# Altium schematic sheet UNG8077_EVB_7801-9031_A_4-KSZ9031.SchDoc
size 416 x 264 mm; SheetNumber: 4; PageTitle: KSZ9031RNX; PageSetup: Record=PageOptions|CenterHorizontal=True|CenterVertical=True|PrintScale=1.02|XCorrection=1.00|YCorrection=1.00|PrintKind=0|BorderSize=5000000|LeftOffset=0|BottomOffset=0|Orientation=2|PaperLength=1000|PaperWidth=1000|Scale=100|PaperSource=7|PrintQuality=-3|MediaType=1|DitherType=10|PrintScaleMode=1|PaperKind=11 x 17|PaperIndex=119; DocumentFullPathAndName: //depot_np_hweng_boards/ung_hweng/UNG_8077_LAN7801-KSZ9031_DemoEVB/A/
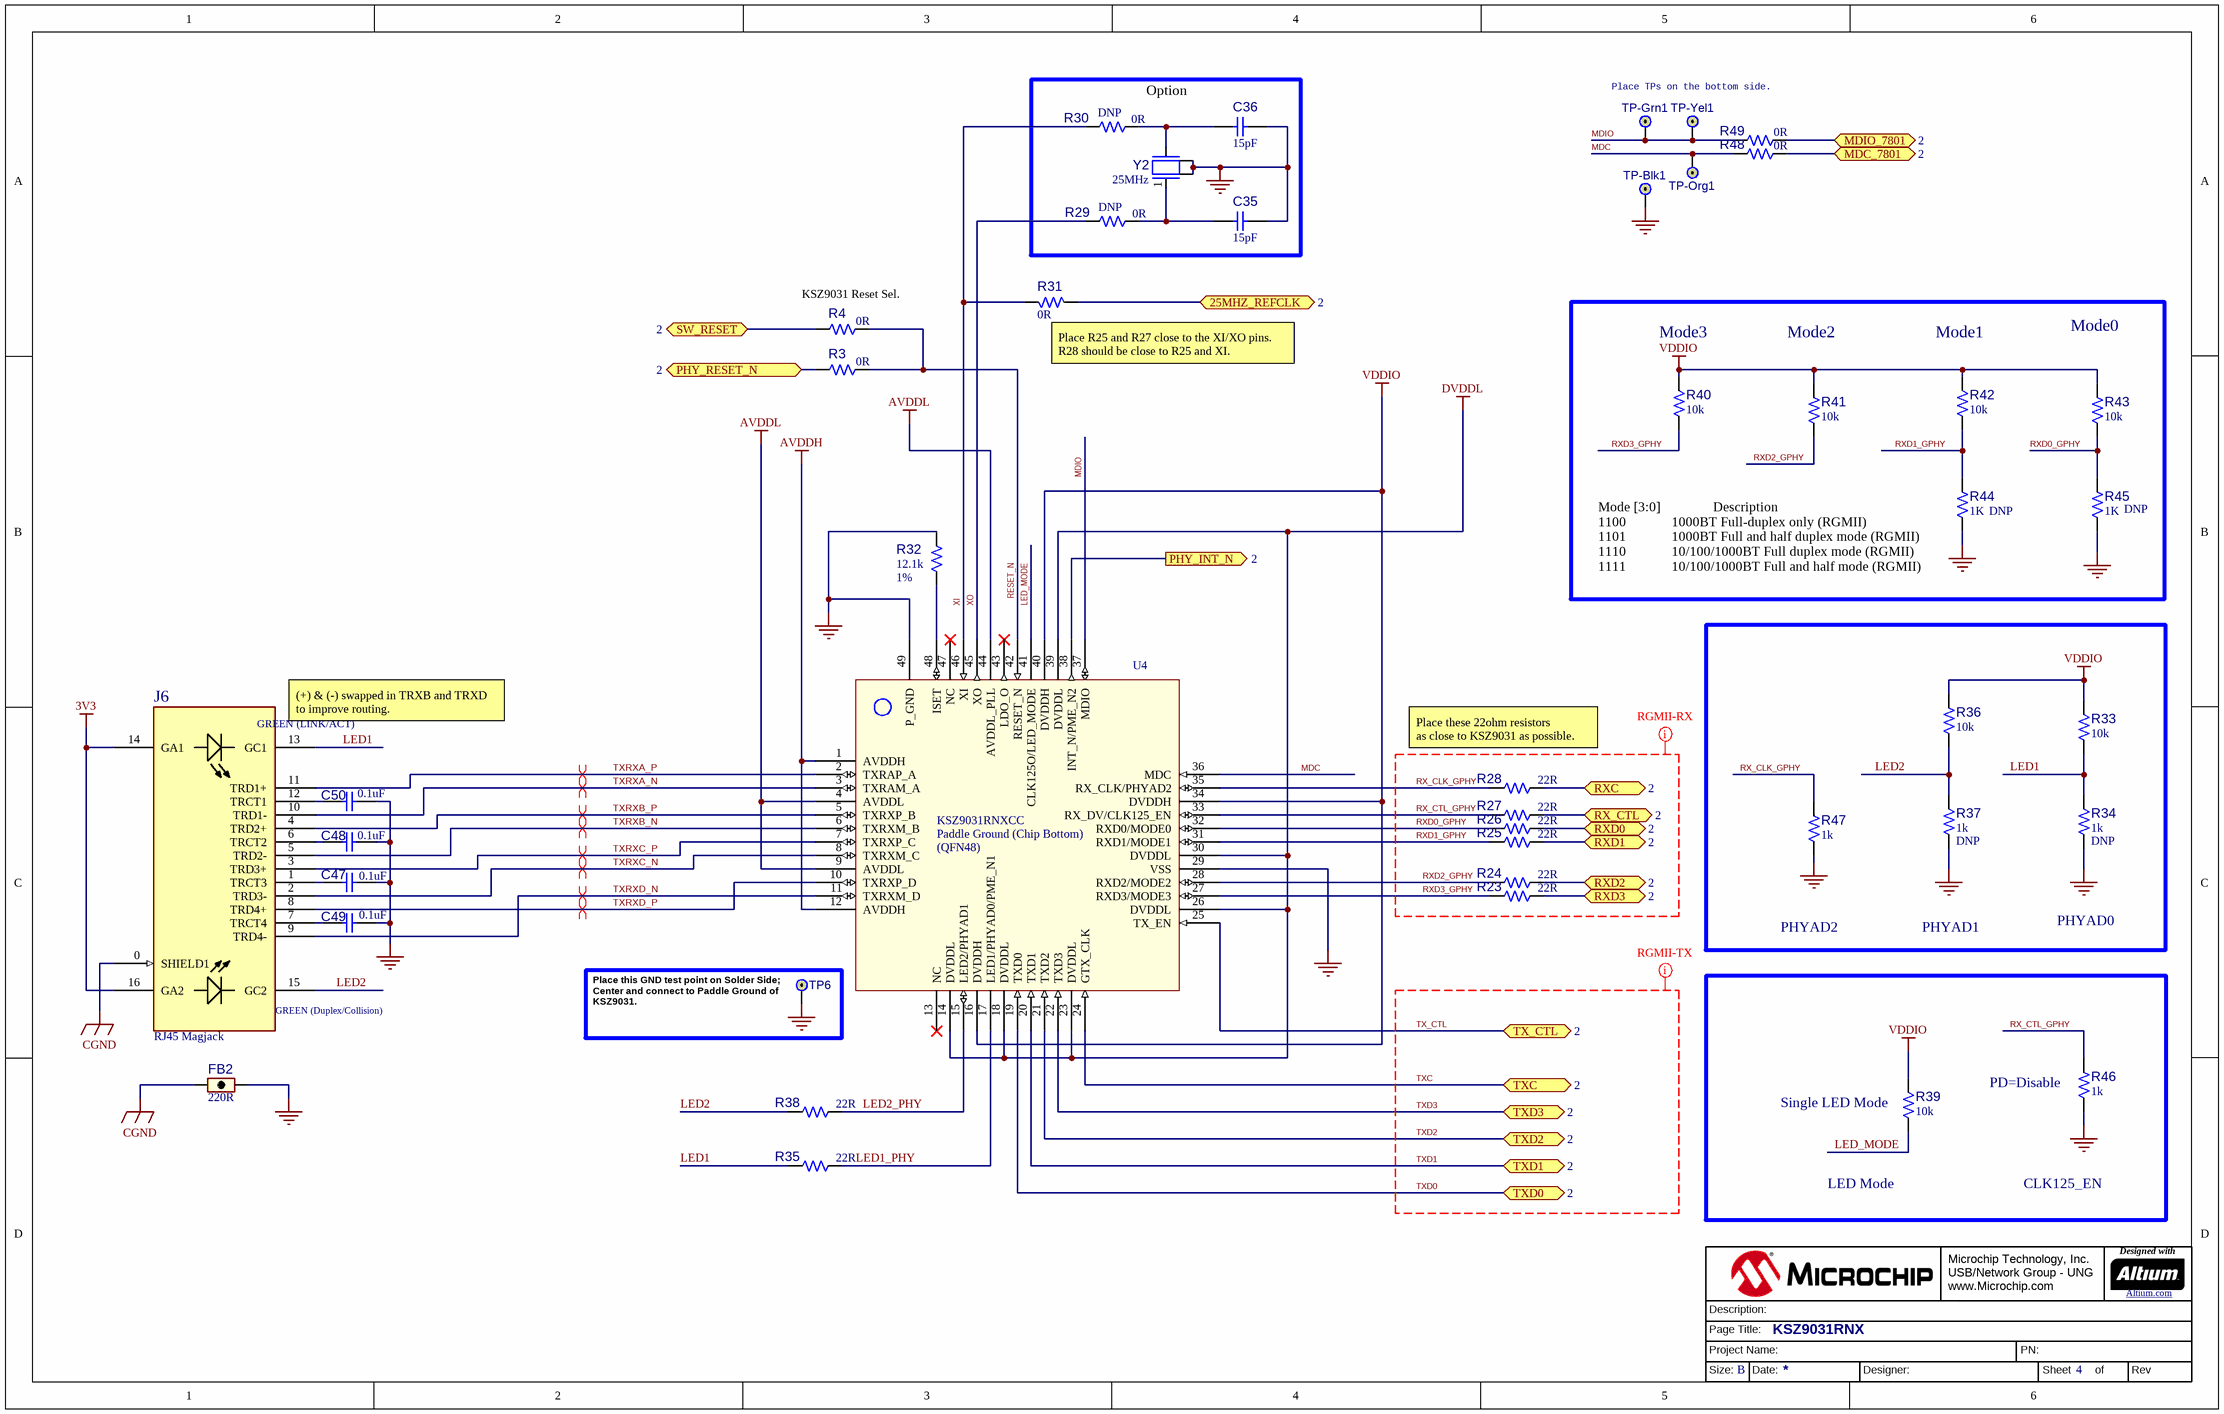
[diagram p0: UNG8077_EVB_7801-9031_A_4-KSZ9031.SchDoc]

## Parts
?  (no value)  (graphical)
C35  value 15pF  [CAP_C_0402]  (hidden comment: Capacitor NP)
C36  value 15pF  [CAP_C_0402]  (hidden comment: Capacitor NP)
C47  value 0.1uF  [CAP_C_0402]  (hidden comment: CAP CER 0.1UF 35V)
C48  value 0.1uF  [CAP_C_0402]  (hidden comment: CAP CER 0.1UF 35V)
C49  value 0.1uF  [CAP_C_0402]  (hidden comment: CAP CER 0.1UF 35V)
C50  value 0.1uF  [CAP_C_0402]  (hidden comment: CAP CER 0.1UF 35V)
FB2  value 220R  [IND_C_0603]  (hidden comment: Ferrite Bead)
J6  RJ45 Magjack  [CON_MODULAR_RJ45_TH_RA_RJMG2012211A0FR]
R3  value 0R  [RES_C_0603]  (hidden comment: Resistor)
R4  value 0R  [RES_C_0603]  (hidden comment: Resistor)
R23  value 22R  [RES_C_0402]  (hidden comment: Resistor)
R24  value 22R  [RES_C_0402]  (hidden comment: Resistor)
R25  value 22R  [RES_C_0402]  (hidden comment: Resistor)
R26  value 22R  [RES_C_0402]  (hidden comment: Resistor)
R27  value 22R  [RES_C_0402]  (hidden comment: Resistor)
R28  value 22R  [RES_C_0402]  (hidden comment: Resistor)
R29  value 0R  Populated: DNP  [RES_C_0603]  (hidden comment: Resistor)
R30  value 0R  Populated: DNP  [RES_C_0603]  (hidden comment: Resistor)
R31  value 0R  [RES_C_0603]  (hidden comment: Resistor)
R32  value 12.1k  Tolerance: 1%  [RES_C_0603]  (hidden comment: Resistor)
R33  value 10k  [RES_C_0603]  (hidden comment: Resistor)
R34  value 1k  Populated: DNP  [RES_C_0603]  (hidden comment: Resistor)
R35  value 22R  [RES_C_0402]  (hidden comment: Resistor)
R36  value 10k  [RES_C_0603]  (hidden comment: Resistor)
R37  value 1k  Populated: DNP  [RES_C_0603]  (hidden comment: Resistor)
R38  value 22R  [RES_C_0402]  (hidden comment: Resistor)
R39  value 10k  [RES_C_0603]  (hidden comment: Resistor)
R40  value 10k  [RES_C_0603]  (hidden comment: Resistor)
R41  value 10k  [RES_C_0603]  (hidden comment: Resistor)
R42  value 10k  [RES_C_0603]  (hidden comment: Resistor)
R43  value 10k  [RES_C_0603]  (hidden comment: Resistor)
R44  value 1K  Populated: DNP  [RES_C_0603]  (hidden comment: Resistor)
R45  value 1K  Populated: DNP  [RES_C_0603]  (hidden comment: Resistor)
R46  value 1k  [RES_C_0603]  (hidden comment: Resistor)
R47  value 1k  [RES_C_0603]  (hidden comment: Resistor)
R48  value 0R  [RES_C_0603]  (hidden comment: Resistor)
R49  value 0R  [RES_C_0603]  (hidden comment: Resistor)
TP6  Jumper  [TP_PAD_VIA_20-10]  (value not drawn)
TP-Blk1  Jumper  [TP_PAD51D36]  (value not drawn)  (no BOM)
TP-Grn1  Jumper  [TP_PAD51D36]  (value not drawn)  (no BOM)
TP-Org1  Jumper  [TP_PAD51D36]  (value not drawn)  (no BOM)
TP-Yel1  Jumper  [TP_PAD51D36]  (value not drawn)  (no BOM)
U4  (no value)  [QFN-48_7x7-EP5.1sq]
Y2  Frequency: 25MHz  [XTAL_4PIN_3M2X2M5]  (hidden comment: XTAL 25MHz 4 pins 3225)

## Blocks framed on the sheet
Option: C35 C36 R29 R30 Y2

## Ports
25MHZ_REFCLK (bidir, see 2), MDC_7801 (bidir, see 2), MDIO_7801 (bidir, see 2), PHY_INT_N (out, see 2), PHY_RESET_N (bidir, see 2), RX_CTL (bidir, see 2), RXC (bidir, see 2), RXD0 (bidir, see 2), RXD1 (bidir, see 2), RXD2 (bidir, see 2), RXD3 (bidir, see 2), SW_RESET (bidir, see 2), TX_CTL (bidir, see 2), TXC (bidir, see 2), TXD0 (bidir, see 2), TXD1 (bidir, see 2), TXD2 (bidir, see 2), TXD3 (bidir, see 2)

## Nets
3V3: J6.14(GA1) J6.16(GA2)
AVDDH: U4.1(AVDDH) U4.12(AVDDH)
AVDDL: U4.4(AVDDL) U4.9(AVDDL) U4.44(AVDDL_PLL)
CGND: FB2.1 J6.0(SHIELD1)
DVDDL: U4.14(DVDDL) U4.18(DVDDL) U4.23(DVDDL) U4.26(DVDDL) U4.30(DVDDL) U4.39(DVDDL)
GND: C35.2 C36.2 C47.2 C48.2 C49.2 C50.2 FB2.2 R32.2 R34.1 R37.1 R44.1 R45.1 R46.1 R47.1 TP6.1(P1) TP-Blk1.1(P1) U4.29(VSS) U4.49(P_GND) Y2.2(GND) Y2.4(GND)
VDDIO: R33.1 R36.1 R39.1 R40.1 R41.1 R42.1 R43.1 U4.16(DVDDH) U4.34(DVDDH) U4.40(DVDDH)
25MHZ_REFCLK: R31.1 ; port 25MHZ_REFCLK
LED1: J6.13(GC1) R33.2 R34.2 R35.1
LED1_PHY: R35.2 U4.17(LED1/PHYAD0/PME_N1)
LED2: J6.15(GC2) R36.2 R37.2 R38.1
LED2_PHY: R38.2 U4.15(LED2/PHYAD1)
LED_MODE: R39.2 U4.41(CLK125O/LED_MODE)
MDC: R48.1 TP-Org1.1(P1) U4.36(MDC)
MDC_7801: R48.2 ; port MDC_7801
MDIO: R49.1 TP-Grn1.1(P1) TP-Yel1.1(P1) U4.37(MDIO)
MDIO_7801: R49.2 ; port MDIO_7801
PHY_INT_N: U4.38(INT_N/PME_N2) ; port PHY_INT_N
PHY_RESET_N: R3.1 ; port PHY_RESET_N
RESET_N: R3.2 R4.2 U4.42(RESET_N)
RX_CLK_GPHY: R28.1 R47.2 U4.35(RX_CLK/PHYAD2)
RX_CTL: R27.2 ; port RX_CTL
RX_CTL_GPHY: R27.1 R46.2 U4.33(RX_DV/CLK125_EN)
RXC: R28.2 ; port RXC
RXD0: R26.2 ; port RXD0
RXD0_GPHY: R26.1 R43.2 R45.2 U4.32(RXD0/MODE0)
RXD1: R25.2 ; port RXD1
RXD1_GPHY: R25.1 R42.2 R44.2 U4.31(RXD1/MODE1)
RXD2: R24.2 ; port RXD2
RXD2_GPHY: R24.1 R41.2 U4.28(RXD2/MODE2)
RXD3: R23.2 ; port RXD3
RXD3_GPHY: R23.1 R40.2 U4.27(RXD3/MODE3)
SW_RESET: R4.1 ; port SW_RESET
TX_CTL: U4.25(TX_EN) ; port TX_CTL
TXC: U4.24(GTX_CLK) ; port TXC
TXD0: U4.19(TXD0) ; port TXD0
TXD1: U4.20(TXD1) ; port TXD1
TXD2: U4.21(TXD2) ; port TXD2
TXD3: U4.22(TXD3) ; port TXD3
TXRXA_N: J6.10(TRD1-) U4.3(TXRAM_A)
TXRXA_P: J6.11(TRD1+) U4.2(TXRAP_A)
TXRXB_N: J6.5(TRD2-) U4.6(TXRXM_B)
TXRXB_P: J6.4(TRD2+) U4.5(TXRXP_B)
TXRXC_N: J6.2(TRD3-) U4.8(TXRXM_C)
TXRXC_P: J6.3(TRD3+) U4.7(TXRXP_C)
TXRXD_N: J6.9(TRD4-) U4.11(TXRXM_D)
TXRXD_P: J6.8(TRD4+) U4.10(TXRXP_D)
XI: R30.1 R31.2 U4.46(XI)
XO: R29.1 U4.45(XO)
NetC35_1: C35.1 R29.2 Y2.1(Osc1)
NetC36_1: C36.1 R30.2 Y2.3(Osc2)
NetC47_1: C47.1 J6.1(TRCT3)
NetC48_1: C48.1 J6.6(TRCT2)
NetC49_1: C49.1 J6.7(TRCT4)
NetC50_1: C50.1 J6.12(TRCT1)
NetR32_1: R32.1 U4.48(ISET)

Not connected (* = marked no-connect by the designer): U4 13(NC)* 43(LDO_O)* 47(NC)*

## Layout directives
net class RGMII-RX: RX_CLK_GPHY, RX_CTL_GPHY, RXD0_GPHY, RXD1_GPHY, RXD2_GPHY, RXD3_GPHY
differential pair; net class GBE: TXRXA_N, TXRXA_P, TXRXB_N, TXRXB_P, TXRXC_N, TXRXC_P, TXRXD_N, TXRXD_P
net class RGMII-TX: TX_CTL, TXC, TXD0, TXD1, TXD2, TXD3

## Notes on the sheet
- Place TPs on the bottom side.
- (near R4) KSZ9031 Reset Sel.
- (near R31) Place R25 and R27 close to the XI/XO pins.
  R28 should be close to R25 and XI.
- (near R40) Mode3
- Mode2
- (near R42) Mode1
- Mode0
- (near R44) Mode [3:0]               Description
  1100             1000BT Full-duplex only (RGMII)
  1101             1000BT Full and half duplex mode (RGMII)
  1110             10/100/1000BT Full duplex mode (RGMII)
  1111             10/100/1000BT Full and half mode (RGMII)
- (near J6) (+) & (-) swapped in TRXB and TRXD to improve routing.
- (near R28) Place these 22ohm resistors
  as close to KSZ9031 as possible.
- PHYAD2
- PHYAD1
- PHYAD0
- (near TP6) Place this GND test point on Solder Side;
  Center and connect to Paddle Ground of KSZ9031.
- (near R46) PD=Disable
- (near R39) Single LED Mode
- LED Mode
- CLK125_EN
- Microchip Technology, Inc.
  USB/Network Group - UNG
  www.Microchip.com
- Designed with
- Altium.com <http://go.altium.com/MicrochipLandingPage_Evaluation.html>
- Page Title:
- Project Name:
- Description:
- PN:
- Size:
- B
- Date:
- Designer:
- Sheet
- of
- Rev
- (in symbol CON RJ-45 RJMG2012211A0FR) GREEN (LINK/ACT); GREEN (Duplex/Collision)
- (in symbol KSZ9031RNXCC) Paddle Ground (Chip Bottom); (QFN48)

## Library data of the parts
? = Title Block B_UNG1_Altium
C35 C36 = CAP1413: Capacitor; Manufacturer 1: Johanson Technology Inc; Manufacturer Part Number 1: 500R07S150JV4T; Description_: CAP HiQ 15pF 50V 5% NP0 2.32GHz SMD 0402; Dev Tools Status: Design; Tolerance: 5%; Temperature Coeffcient: NP0; ESR: 0.033R; Type: HiQ; Owner: Gabor Bihari; Populated: YES; MCHP-ID: CAP1413; Revision: A; Status: MCL Design; ComponentLink1URL: https://chn-vm-apps.microchip.com/mchprepo/parts/Datasheets/http://www.johansontechnology.com/downloads/JTI-CAT-MLCC-HighQ.pdf; ComponentLink1Description: Datasheet; Operating Temperature: -55°C to 125°C; Category: Capacitor; Supplier 1: Digi-Key; Supplier Part Number 1: 712-1261-1-ND; Quantity Override: 1
C47-C50 = CAP1463: Capacitor; Manufacturer 1: TDK Corporation; Manufacturer Part Number 1: C1005X7R1H104K050BB; Tolerance: 10%; Description_: CAP CER 0.1uF 50V 10% X7R SMD 0402; Dev Tools Status: Design; Temperature Coeffcient: X7R; Type: Ceramic; Owner: Jamus Griego; Populated: YES; Revision: A; ComponentLink1URL: https://chn-vm-apps.microchip.com/mchprepo/parts/Datasheets/TDKMLCCCapRange.pdf; ComponentLink1Description: Datasheets; Operating Temperature: -55C to +125C; Category: Capacitor; Supplier 1: Digi-Key; Supplier Part Number 1: 445-5932-1-ND; MCHP-ID: CAP1463; Status: MCL Design; Quantity Override: 1
FB2 = IND1313: Manufacturer 1: Murata Electronics North America; Manufacturer Part Number 1: BLM18EG221SN1D; Description_: FERRITE 220R @ 100MHz 2A SMD 0603; Dev Tools Status: Design; Owner: Razvan Cristescu; Populated: YES; MCHP-ID: IND1313; Revision: A; Symbol: Ferrite Bead; Status: MCL Design; ComponentLink1Description: Datasheet; Package: 0603; Type: Ferrite Bead; Category: Inductor; Supplier 1: Digi-Key; Supplier Part Number 1: 490-3992-6-ND; Quantity Override: 1
J6 = CON RJ-45 RJMG2012211A0FR: Manufacturer 1: Amphenol Commercial Products; Populated: Yes; Description_: CON MODULAR RJ45 MAGJACK TH R/A; Manufacturer Part Number 1: RJMG2012211A0FR; RoHS: RoHS Compliant; ComponentLink1URL: https://www.amphenolcanada.com/ProductSearch/Drawings/AC/RJMG2012211A0FR.PDF; ComponentLink1Description: Datasheet; Supplier 1: Digikey; Supplier Part Number 1: RJMG2012211A0FR-ND; Value: RJ45 Magjack
R3 R4 R31 R48 R49 = RSMT0001: Manufacturer 1: NIC Components; Manufacturer Part Number 1: NRC06Z0TRF; Description_: RES TKF 0R 1/10W SMD 0603; Power: 1/10W; Populated: Yes; MCHP-ID: RSMT0001; Revision: 2; Status: Production; ComponentLink1URL: https://chn-vm-apps.microchip.com/mchprepo/parts/Datasheets/nrc.pdf; ComponentLink1Description: Datasheet; Operating Temperature: -55C to +155C; Category: Resistor; Type: RES SMD; Composition: TKF; Manufacturer 2: Panasonic; Manufacturer Part Number 2: ERJ-3GSY0R00V; Manufacturer 3: Panasonic; Manufacturer Part Number 3: ERJ-3GEY0R00V; Manufacturer 4: Stackpole Electronics Inc; Manufacturer Part Number 4: RMCF0603ZT0R00; Manufacturer 5: Vishay; Manufacturer Part Number 5: CRCW06030000Z0EA; Manufacturer 6: Stackpole Electronics Inc; Manufacturer Part Number 6: RMCF 1/16 0 R; Manufacturer 7: Yageo; Manufacturer Part Number 7: RC0603JR-070RL; Manufacturer 8: KOA Speer; Manufacturer Part Number 8: RK73Z1JTTP; Manufacturer 9: ROHM; Manufacturer Part Number 9: MCR03EZPJ000; Supplier 1: NIC Components; Supplier Part Number 1: NRC06Z0TRF; Supplier 2: Digi-Key; Supplier Part Number 2: P0.0GTR-ND; Supplier 3: Digi-Key; Supplier Part Number 3: RMCF0603ZT0R00TR-ND; Supplier 4: Digi-Key; Supplier Part Number 4: RMCF0603ZT0R00CT-ND; Supplier 5: Digi-Key; Supplier Part Number 5: 541-0.0GCT-ND; Supplier 6: Digi-Key; Supplier Part Number 6: RMCF1/160RTR-ND; Supplier 7: Digi-Key; Supplier Part Number 7: 311-0.0GRCT-ND; Supplier 8: KOA Speer; Supplier Part Number 8: RK73Z1JTTP; Supplier 9: Digi-Key; Supplier Part Number 9: RHM0.0GCT-ND; Quantity Override: 1
  R31: Package: 0603
R23-R28 R35 R38 = RES1474: Manufacturer 1: Panasonic Electronic Components; Manufacturer Part Number 1: ERJ-2RKF22R0X; Tolerance: 1%; Description_: RES TKF 22R 1% 1/20W SMD 0402; Dev Tools Status: Design; Temperature Coeffcient: 100ppm/C; Circuit Type: Isolated; Power: 1/10W; Owner: Mike Ragsdale; Populated: YES; MCHP-ID: RES1474; Package: 0402; Revision: 1; Symbol: Resistor; Status: MCL Design; Operating Temperature: -55C to +155C; Category: Resistor; Type: RES SMD; Composition: TKF; Supplier 1: Digi-Key; Supplier Part Number 1: P22.0LCT-ND; Quantity Override: 1
R29 R30 = RSMT0001: Manufacturer 1: NIC Components; Manufacturer Part Number 1: NRC06Z0TRF; Description_: RES TKF 0R 1/10W SMD 0603; Power: 1/10W; MCHP-ID: RSMT0001; Revision: 2; Status: Production; ComponentLink1URL: https://chn-vm-apps.microchip.com/mchprepo/parts/Datasheets/nrc.pdf; ComponentLink1Description: Datasheet; Operating Temperature: -55C to +155C; Category: Resistor; Type: RES SMD; Composition: TKF; Manufacturer 2: Panasonic; Manufacturer Part Number 2: ERJ-3GSY0R00V; Manufacturer 3: Panasonic; Manufacturer Part Number 3: ERJ-3GEY0R00V; Manufacturer 4: Stackpole Electronics Inc; Manufacturer Part Number 4: RMCF0603ZT0R00; Manufacturer 5: Vishay; Manufacturer Part Number 5: CRCW06030000Z0EA; Manufacturer 6: Stackpole Electronics Inc; Manufacturer Part Number 6: RMCF 1/16 0 R; Manufacturer 7: Yageo; Manufacturer Part Number 7: RC0603JR-070RL; Manufacturer 8: KOA Speer; Manufacturer Part Number 8: RK73Z1JTTP; Manufacturer 9: ROHM; Manufacturer Part Number 9: MCR03EZPJ000; Supplier 1: NIC Components; Supplier Part Number 1: NRC06Z0TRF; Supplier 2: Digi-Key; Supplier Part Number 2: P0.0GTR-ND; Supplier 3: Digi-Key; Supplier Part Number 3: RMCF0603ZT0R00TR-ND; Supplier 4: Digi-Key; Supplier Part Number 4: RMCF0603ZT0R00CT-ND; Supplier 5: Digi-Key; Supplier Part Number 5: 541-0.0GCT-ND; Supplier 6: Digi-Key; Supplier Part Number 6: RMCF1/160RTR-ND; Supplier 7: Digi-Key; Supplier Part Number 7: 311-0.0GRCT-ND; Supplier 8: KOA Speer; Supplier Part Number 8: RK73Z1JTTP; Supplier 9: Digi-Key; Supplier Part Number 9: RHM0.0GCT-ND; Quantity Override: 1
R32 = RSMT0414: Manufacturer 1: Panasonic; Manufacturer Part Number 1: ERJ-3EKF1212V; Description_: RES TKF 12.1k 1% 1/10W SMD 0603; Dev Tools Status: Production; Voltage: 75V; Temperature Coeffcient: 100ppm/C; Power: 1/10W; Populated: Yes; MCHP-ID: RSMT0414; Revision: 1; Status: MCL Design; ComponentLink1URL: https://chn-vm-apps.microchip.com/mchprepo/parts/Datasheets/AOA0000CE2.pdf; ComponentLink1Description: Datasheet; Operating Temperature: -55C to +155C; Category: Resistor; Type: RES SMD; Composition: TKF; Manufacturer 2: ROHM; Manufacturer Part Number 2: MCR03EZPFX1212; Manufacturer 3: SET; Manufacturer Part Number 3: RMCF1/1612.1K1%TR; Supplier 1: Digi-Key; Supplier Part Number 1: P12.1KHCT-ND; Supplier 2: Digi-Key; Supplier Part Number 2: RHM12.1KHCT-ND; Supplier 3: SET; Supplier Part Number 3: RMCF1/1612.1K1%TR; Quantity Override: 1
R33 R36 R39-R43 = RES0191: Manufacturer 1: Panasonic; Manufacturer Part Number 1: ERJ-3GEYJ103V; Description_: RES TKF 10k 5% 1/10W SMD 0603; Voltage: 75V; Temperature Coeffcient: 200ppm/C; Power: 1/10W; Populated: Yes; MCHP-ID: RES0191; Revision: 2; Status: Production; ComponentLink1URL: https://chn-vm-apps.microchip.com/mchprepo/parts/Datasheets/AOA0000CE1.pdf; ComponentLink1Description: Datasheet; Operating Temperature: -55C to +155C; Category: Resistor; Type: RES SMD; Composition: TKF; Manufacturer 2: NIC Components; Manufacturer Part Number 2: NRC06J103TRF; Manufacturer 3: Yageo; Manufacturer Part Number 3: RC0603JR-0710KL; Supplier 1: Digi-Key; Supplier Part Number 1: P10KGCT-ND; Supplier 2: Digi-Key; Supplier Part Number 2: P10KGTR-ND; Supplier 3: NIC Components; Supplier Part Number 3: NRC06J103TRF; Supplier 4: Digi-Key; Supplier Part Number 4: 311-10KGRTR-ND; Quantity Override: 1
R34 R37 = RSMT0138: Manufacturer 1: Panasonic; Manufacturer Part Number 1: ERJ-3EKF1001V; Tolerance: 1%; Description_: RES TKF 1k 1% 1/10W SMD 0603; Dev Tools Status: Production; Voltage: 75V; Temperature Coeffcient: 100ppm/C; Power: 1/10W; MCHP-ID: RSMT0138; Package: 0603; Revision: 2; Symbol: Resistor; Status: MCL Design; ComponentLink1URL: https://chn-vm-apps.microchip.com/mchprepo/parts/Datasheets/AOA0000CE2.pdf; ComponentLink1Description: Datasheet; Operating Temperature: -55C to +155C; Category: Resistor; Type: RES SMD; Composition: TKF; Manufacturer 2: Yageo; Manufacturer Part Number 2: RC0603FR-071KL; Manufacturer 3: ROHM; Manufacturer Part Number 3: MCR03EZPFX1001; Manufacturer 4: Stackpole Electronics Inc; Manufacturer Part Number 4: RMCF0603FT1K00; Manufacturer 5: Stackpole Electronics Inc; Manufacturer Part Number 5: RMCF 1/16 1K 1% R; Manufacturer 6: Vishay; Manufacturer Part Number 6: CRCW06031K00FKEA; Manufacturer 7: Stackpole Electronics Inc; Manufacturer Part Number 7: RMCF1/161.0K1%TR; Manufacturer 8: TE Connectivity; Manufacturer Part Number 8: 1622866-1; Supplier 1: Digi-Key; Supplier Part Number 1: P1.00KHCT-ND; Supplier 2: Digi-Key; Supplier Part Number 2: P1.00KHTR-ND; Supplier 3: Digi-Key; Supplier Part Number 3: 311-1.00KHRCT-ND; Supplier 4: Digi-Key; Supplier Part Number 4: RHM1.00KHCT-ND; Supplier 5: Digi-Key; Supplier Part Number 5: RMCF1/161KFRTR-ND; Supplier 6: Digi-Key; Supplier Part Number 6: RMCF0603FT1K00TR-ND; Supplier 7: Newark; Supplier Part Number 7: 52K8015; Supplier 8: Stackpole Electronics Inc; Supplier Part Number 8: RMCF1/161.0K1%TR; Supplier 9: Digi-Key; Supplier Part Number 9: A106049CT-ND; Quantity Override: 1
R44 R45 = RSMT0047: Manufacturer 1: Panasonic; Manufacturer Part Number 1: ERJ-3GEYJ102V; Tolerance: 5%; Description_: RES TKF 1k 5% 1/10W SMD 0603; Voltage: 75V; Temperature Coeffcient: 200ppm/C; Power: 1/10W; MCHP-ID: RSMT0047; Revision: 1; Status: Production; ComponentLink1URL: https://chn-vm-apps.microchip.com/mchprepo/parts/Datasheets/AOA0000CE1.pdf; ComponentLink1Description: Datasheet; Operating Temperature: -55C to +155C; Category: Resistor; Type: RES SMD; Composition: TKF; Manufacturer 2: KOA Speer; Manufacturer Part Number 2: RK73B1JTTD102J; Manufacturer 3: Panasonic; Manufacturer Part Number 3: ERJ-3GSYJ102V; Manufacturer 4: ROHM; Manufacturer Part Number 4: MCR03EZHJ1K; Manufacturer 5: ROHM; Manufacturer Part Number 5: MCR03FZHJ1001; Manufacturer 6: Stackpole Electronics Inc; Manufacturer Part Number 6: RMCF 1/16 1K 5% R; Manufacturer 7: Yageo; Manufacturer Part Number 7: RC0603JR-071KL; Supplier 1: Digi-Key; Supplier Part Number 1: P1.0KGCT-ND; Supplier 2: Digi-Key; Supplier Part Number 2: P1.0KGTR-ND; Supplier 3: KOA Speer; Supplier Part Number 3: RK73B1JTTD102J; Supplier 4: ROHM; Supplier Part Number 4: MCR03EZHJ1K; Supplier 5: ROHM; Supplier Part Number 5: MCR03FZHJ1001; Supplier 6: Stackpole Electronics Inc; Supplier Part Number 6: RMCF 1/16 1K 5% R; Supplier 7: Digi-Key; Supplier Part Number 7: 311-1.0KGRTR-ND; Quantity Override: 1
R46 R47 = RSMT0138: Manufacturer 1: Panasonic; Manufacturer Part Number 1: ERJ-3EKF1001V; Tolerance: 1%; Description_: RES TKF 1k 1% 1/10W SMD 0603; Dev Tools Status: Production; Voltage: 75V; Temperature Coeffcient: 100ppm/C; Power: 1/10W; Populated: Yes; MCHP-ID: RSMT0138; Package: 0603; Revision: 2; Symbol: Resistor; Status: MCL Design; ComponentLink1URL: https://chn-vm-apps.microchip.com/mchprepo/parts/Datasheets/AOA0000CE2.pdf; ComponentLink1Description: Datasheet; Operating Temperature: -55C to +155C; Category: Resistor; Type: RES SMD; Composition: TKF; Manufacturer 2: Yageo; Manufacturer Part Number 2: RC0603FR-071KL; Manufacturer 3: ROHM; Manufacturer Part Number 3: MCR03EZPFX1001; Manufacturer 4: Stackpole Electronics Inc; Manufacturer Part Number 4: RMCF0603FT1K00; Manufacturer 5: Stackpole Electronics Inc; Manufacturer Part Number 5: RMCF 1/16 1K 1% R; Manufacturer 6: Vishay; Manufacturer Part Number 6: CRCW06031K00FKEA; Manufacturer 7: Stackpole Electronics Inc; Manufacturer Part Number 7: RMCF1/161.0K1%TR; Manufacturer 8: TE Connectivity; Manufacturer Part Number 8: 1622866-1; Supplier 1: Digi-Key; Supplier Part Number 1: P1.00KHCT-ND; Supplier 2: Digi-Key; Supplier Part Number 2: P1.00KHTR-ND; Supplier 3: Digi-Key; Supplier Part Number 3: 311-1.00KHRCT-ND; Supplier 4: Digi-Key; Supplier Part Number 4: RHM1.00KHCT-ND; Supplier 5: Digi-Key; Supplier Part Number 5: RMCF1/161KFRTR-ND; Supplier 6: Digi-Key; Supplier Part Number 6: RMCF0603FT1K00TR-ND; Supplier 7: Newark; Supplier Part Number 7: 52K8015; Supplier 8: Stackpole Electronics Inc; Supplier Part Number 8: RMCF1/161.0K1%TR; Supplier 9: Digi-Key; Supplier Part Number 9: A106049CT-ND; Quantity Override: 1
TP6 = TEST PAD TH VIA 20X10: Manufacturer Part Number: none; Description_: TEST Pad, VIA sized, 20pad, 10 FHS; Manufacturer: none; Category: Non BOM Item; Type: Male; Mounting Type: Through Hole; Supplier 1: none; Supplier Part Number 1: none; DNP: DNP
TP-Blk1 TP-Grn1 TP-Org1 TP-Yel1 = TEST PAD TH 51X36: Manufacturer Part Number: none; Description_: TEST Pad, PIN sized, 51pad, 36 FHS; Populated: Yes; Manufacturer: none; Category: Non BOM Item; Type: Male; Mounting Type: Through Hole; Supplier 1: none; Supplier Part Number 1: none
U4 = KSZ9031RNXCC: KSZ9031RNXCC 10/100/100 GPHY with RGMII 48QFN; Manufacturer 1: Microchip; Part Footprint Checked: Carl Johnson; Description_: KSZ9031RNXCC Gigabit Ethernet PHY with RGMII; Populated: Yes; Owner: Jennifer Hancock; Package: 48QFN, 7x7, 5.1x5.1 EPAD; RoHS: Yes; Manufacturer Part Number 1: KSZ9031RNXCC; Supplier 1: Mouser; Supplier Part Number 1: 998-KSZ9031RNXCC; Part Checked: Jennifer Hancock; Part 3D Model Checked: *; Status: New
Y2 = XTAL 25MHz 4 pins 3225: Crystal 25MHz 4 pins 3225; Manufacturer 1: Abracon; Manufacturer Part Number 1: ABM8G-25.000MHZ-B4Y-T; Frequency Stability: ±30ppm; Load Capacitance: 10pF; Operating Mode: Fundamental; Populated: Yes; Description_: Crystal 25MHz 10pF SMD 4Pin DFN LCC; Revision: A; RoHS: RoHS Compliant; Category: Crystals and Oscillators; Packaging: Cut Tape (CT); Type: 25MHz Crystal; Frequency Tolerance: ±30ppm; Operating Temperature: -20°C ~ 70°C; Package / Case: 4-SMD, No Lead (DFN, LCC); Size / Dimension: 3.2 mm x 2.5mm; ComponentLink1URL: http://nyusperforce.smsc.com//depot_np_hweng_boards/altium_libraries/datasheets/Abracon/ABM8G-10572.pdf; ComponentLink1Description: Datasheet; Supplier 1: Mouser; Supplier Part Number 1: 815-ABM8G-25-B4Y-T